# Altium schematic sheet UART.SchDoc: Grandmaster UART, Antennas, and RTC
size Tabloid; Author: N Smith; Revision: A; SheetNumber: 3; SheetTotal: 6; Customer: 01910
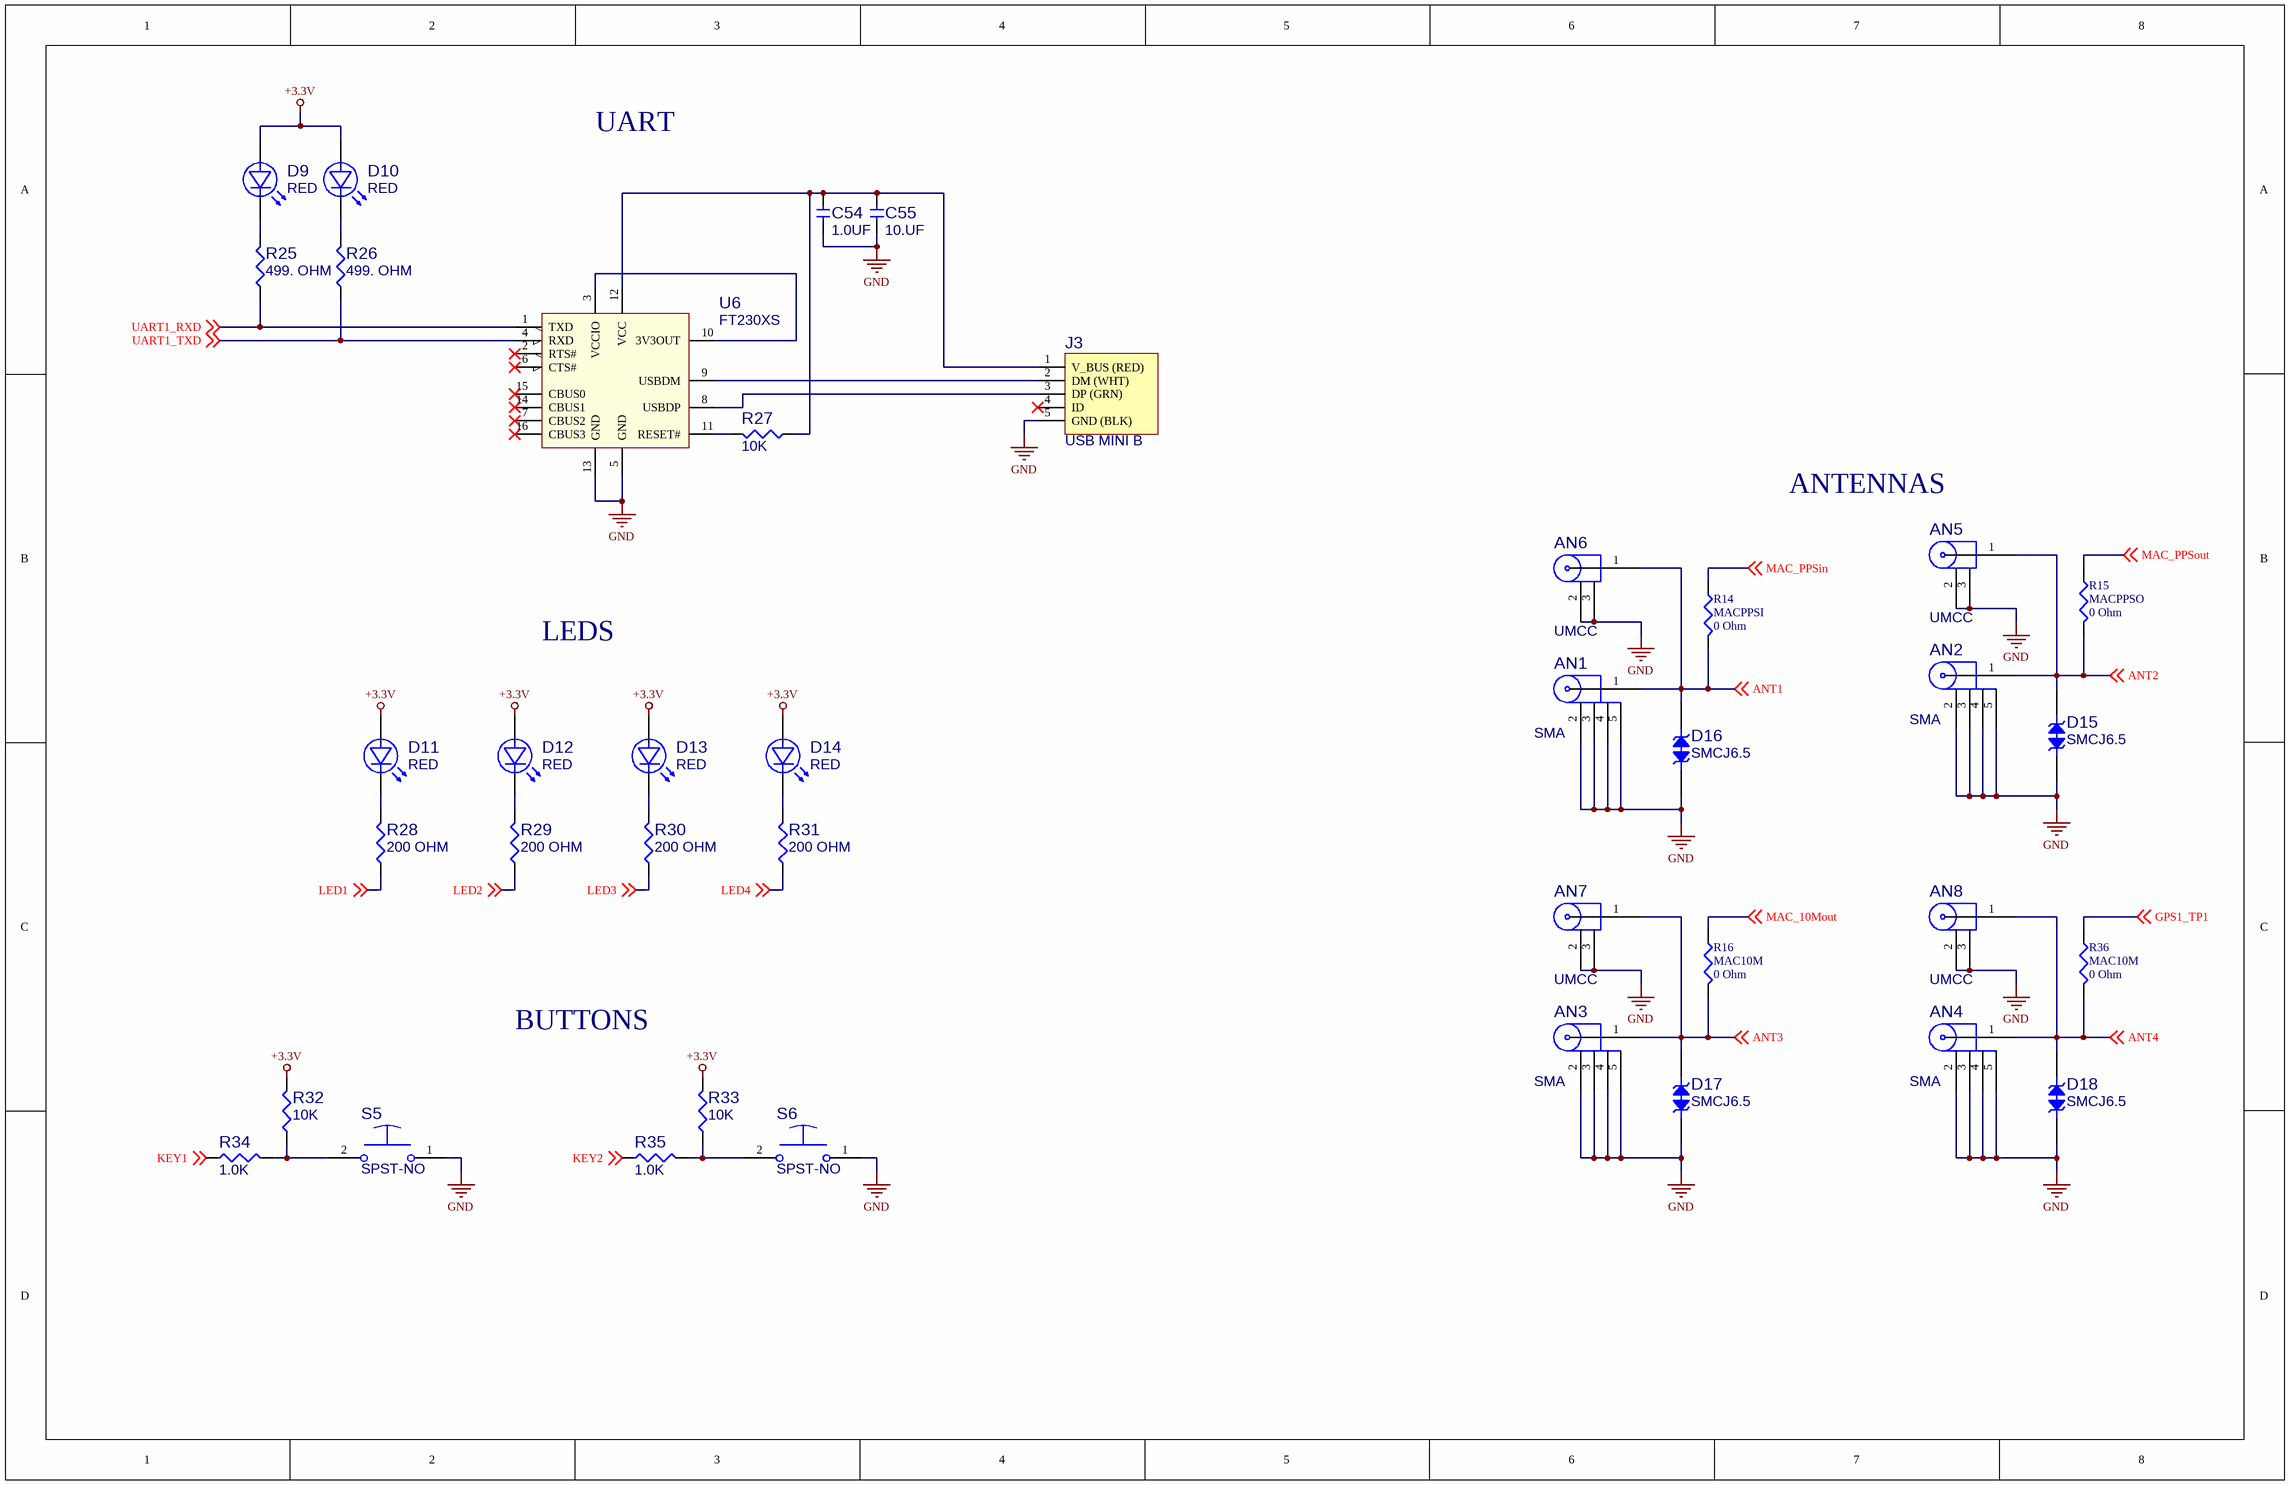
[diagram p0: UART.SchDoc]

## Parts
AN1  value SMA  [AMPHENOL-901-143-6RFX]  (hidden comment: RF-901-143-6FRX)
AN2  value SMA  [AMPHENOL-901-143-6RFX]  (hidden comment: RF-901-143-6FRX)
AN3  value SMA  [AMPHENOL-901-143-6RFX]  (hidden comment: RF-901-143-6FRX)
AN4  value SMA  [AMPHENOL-901-143-6RFX]  (hidden comment: RF-901-143-6FRX)
AN5  value UMCC  [U.FL UMCC JACK]  (hidden comment: 1909763-1)
AN6  value UMCC  [U.FL UMCC JACK]  (hidden comment: 1909763-1)
AN7  value UMCC  [U.FL UMCC JACK]  (hidden comment: 1909763-1)
AN8  value UMCC  [U.FL UMCC JACK]  (hidden comment: 1909763-1)
C54  value 1.0UF  [CAPC2012X14N]  (hidden comment: CAP_0805_1UF_25V)
C55  value 10.UF  [CAPC1608X10N]  (hidden comment: GRT188R61E106ME13D)
D9  RED  [DIOM1608X06N]
D10  RED  [DIOM1608X06N]
D11  RED  [DIOM1608X06N]
D12  RED  [DIOM1608X06N]
D13  RED  [DIOM1608X06N]
D14  RED  [DIOM1608X06N]
D15  value SMCJ6.5  [DIOM6959X26N]  (hidden comment: SMCJ6.5CA)
D16  value SMCJ6.5  [DIOM6959X26N]  (hidden comment: SMCJ6.5CA)
D17  value SMCJ6.5  [DIOM6959X26N]  (hidden comment: SMCJ6.5CA)
D18  value SMCJ6.5  [DIOM6959X26N]  (hidden comment: SMCJ6.5CA)
J3  value USB MINI B  [USB_1734035]  (hidden comment: USB_B_1734035)
R14  MACPPSI  value 0 Ohm  [J1-0603]
R15  MACPPSO  value 0 Ohm  [J1-0603]
R16  MAC10M  value 0 Ohm  [J1-0603]
R25  value 499. OHM  [RESC1005X04N]  (hidden comment: ERJ-2RKF4990X)
R26  value 499. OHM  [RESC1005X04N]  (hidden comment: ERJ-2RKF4990X)
R27  value 10K  [RESC1608X50N]  (hidden comment: ERJ-3EKF1002V)
R28  value 200 OHM  [RESC1608X50N]  (hidden comment: ERJ-3EKF2000V)
R29  value 200 OHM  [RESC1608X50N]  (hidden comment: ERJ-3EKF2000V)
R30  value 200 OHM  [RESC1608X50N]  (hidden comment: ERJ-3EKF2000V)
R31  value 200 OHM  [RESC1608X50N]  (hidden comment: ERJ-3EKF2000V)
R32  value 10K  [RESC1608X50N]  (hidden comment: ERJ-3EKF1002V)
R33  value 10K  [RESC1608X50N]  (hidden comment: ERJ-3EKF1002V)
R34  value 1.0K  [RESC1608X50N]  (hidden comment: ERJ-3EKF1001V)
R35  value 1.0K  [RESC1608X50N]  (hidden comment: ERJ-3EKF1001V)
R36  MAC10M  value 0 Ohm  [J1-0603]
S5  value SPST-NO  [OMRON-B3U-1000P]  (hidden comment: B3U-1000P)
S6  value SPST-NO  [OMRON-B3U-1000P]  (hidden comment: B3U-1000P)
U6  value FT230XS  [SOP64P600X170-16N]  (hidden comment: FT230XS-R)

## Nets
+3.3V: D9.2(A) D10.2(A) D11.2(A) D12.2(A) D13.2(A) D14.2(A) R32.2 R33.2
GND: AN1.2 AN1.3 AN1.4 AN1.5 AN2.2 AN2.3 AN2.4 AN2.5 AN3.2 AN3.3 AN3.4 AN3.5 AN4.2 AN4.3 AN4.4 AN4.5 AN5.2 AN5.3 AN6.2 AN6.3 AN7.2 AN7.3 AN8.2 AN8.3 C54.1 C55.1 D15.K D16.K D17.K D18.K J3.5(GND_(BLK)) S5.1 S6.1 U6.5(GND) U6.13(GND)
ANT1: AN1.1 AN6.1 D16.A R14.2 ; off-sheet ANT1
ANT2: AN2.1 AN5.1 D15.A R15.2 ; off-sheet ANT2
ANT3: AN3.1 AN7.1 D17.A R16.2 ; off-sheet ANT3
ANT4: AN4.1 AN8.1 D18.A R36.2 ; off-sheet ANT4
GPS1_TP1: R36.1 ; off-sheet GPS1_TP1
KEY1: R34.1 ; off-sheet KEY1
KEY2: R35.1 ; off-sheet KEY2
LED1: R28.1 ; off-sheet LED1
LED2: R29.1 ; off-sheet LED2
LED3: R30.1 ; off-sheet LED3
LED4: R31.1 ; off-sheet LED4
MAC_10Mout: R16.1 ; off-sheet MAC_10Mout
MAC_PPSin: R14.1 ; off-sheet MAC_PPSin
MAC_PPSout: R15.1 ; off-sheet MAC_PPSout
UART1_RXD: R25.1 U6.1(TXD) ; off-sheet UART1_RXD
UART1_TXD: R26.1 U6.4(RXD) ; off-sheet UART1_TXD
NetC54_2: C54.2 C55.2 J3.1(V_BUS_(RED)) R27.1 U6.12(VCC)
NetD9_1: D9.1(K) R25.2
NetD10_1: D10.1(K) R26.2
NetD11_1: D11.1(K) R28.2
NetD12_1: D12.1(K) R29.2
NetD13_1: D13.1(K) R30.2
NetD14_1: D14.1(K) R31.2
NetJ3_2: J3.2(DM_(WHT)) U6.9(USBDM)
NetJ3_3: J3.3(DP_(GRN)) U6.8(USBDP)
NetR27_2: R27.2 U6.11(RESET#)
NetR32_1: R32.1 R34.2 S5.2
NetR33_1: R33.1 R35.2 S6.2
NetU6_3: U6.3(VCCIO) U6.10(3V3OUT)

Not connected (* = marked no-connect by the designer): J3 4(ID)*; U6 2(RTS#)* 6(CTS#)* 7(CBUS2)* 14(CBUS1)* 15(CBUS0)* 16(CBUS3)*

## Notes on the sheet
- UART
- ANTENNAS
- LEDS
- BUTTONS

## Library data of the parts
AN1-AN4 = RF-901-143-6FRX: CONN, JACK, SMA, FEMALE, 50 OHM, R/A, GOLD, TH; MFG PART NUM: 901-143-6RFX; VALENTIUM PART NUM: <VALENTIUM>; MFG Name: AMPHENOL; MAXTEMP: 165C; MINTEMP: -65C; P2: 50 OHM; MODIFY DATE: 10/10/2013; CATEGORY: CONN, JACK; OTHER: GOLD; P1: FEMALE; P3: R/A; SIZE: 9.86MM HT; DESC: CONN, JACK, SMA, FEMALE, 50 OHM, R/A, GOLD, TH; Supplier 1: Digi-Key; Supplier Part Number 1: ARFX1232-ND
AN5-AN8 = UMCC: CONN, JACK, UMCC, MALE, 50 OHM, U.FL, GOLD, SMT; VALENTIUM PART NUM: <VALENTIUM>; MFG Name: TE; MAXTEMP: 90C; MINTEMP: -40C; P2: 50 OHM; P3: ST; MFG PART NUM: 1909763-1; MODIFY DATE: 10/10/2013; CATEGORY: CONN, JACK; OTHER: GOLD; P1: MALE; SIZE: 1.25MM HT; DESC: CONN, JACK, UMCC, MALE, 50 OHM, U.FL, GOLD, SMT; Supplier 1: Digi-Key; Supplier Part Number 1: A118077CT-ND
C54 = CAP_0805_1UF_25V: CAP, CER, 1.0UF, 25V, 10%, X5R, 0805; MFG PART NUM: 08053D105KAT2A; VALENTIUM PART NUM: <VALENTIUM>; MFG NAME: AVX; MAXTEMP: 85C; MINTEMP: -55C; MODIFY DATE: 10/23/2013; CATEGORY: CAP, CER; Date: 4/11/2006 3:37:28 PM; SHEETPART: *; P1: 10%; P2: 25V; P3: X5R; Size: 0805; Supplier 1: Digi-Key; Supplier Part Number 1: 478-1409-1-ND; DESC: CAP, CER, 1.0UF, 25V, 10%, X5R, 0805
C55 = CAP_0603_10UF_25V: CAP, CER, 10.UF, 25V, 20%, X5R, AEC-Q200, 0603; VALENTIUM PART NUM: <VALENTIUM>; MFG NAME: MURATA; MAXTEMP: 85C; MINTEMP: -55C; CATEGORY: CAP, CER; MFG PART NUM: GRT188R61E106ME13D; MODIFY DATE: 10/23/2013; Date: 7/25/2013; SHEETPART: *; P1: 20%; OTHER: AEC-Q200; P2: 25V; P3: X5R; Size: 0603; DESC: CAP, CER, 10.UF, 25V, 20%, X5R, AEC-Q200, 0603; Supplier 1: Digi-Key; Supplier Part Number 1: 490-12323-6-ND
D9-D14 = SMTLED_RED_0603_SML: LED, RED, SML-LX0603, 635NM, 2V, 20MA, 0603; MFG PART NUM: SML-LX0603IW-TR; VALENTIUM PART NUM: <VALENTIUM>; MFG NAME: LUMEX; MAXTEMP: 85C; MINTEMP: -25C; MODIFY DATE: 9/4/2013; CATEGORY: LED; OTHER: SML-LX0603; P1: 635NM; P2: 2V; P3: 20MA; SIZE: 0603; SHEETPART: *; DESC: LED, RED, SML-LX0603, 635NM, 2V, 20MA, 0603; Supplier 1: Digi-Key; Supplier Part Number 1: 67-1548-1-ND; VALUE: RED
D15-D18 = SMCJ6.5CA: DIO, TVS, SMCJ6.5, 6.5V, BIDIR, 1.5KW, SMC; VALENTIUM PART NUM: <VALENTIUM>; MFG NAME: LITTELFUSE; MAXTEMP: 150C; MINTEMP: -55C; OTHER: SMCJ; MFG PART NUM: SMCJ6.5CA; MODIFY DATE: 9/4/2013; CATEGORY: DIO, TVS; P1: 6.5V; P2: BIDIR; P3: 1.5KW; SIZE: SMC; SHEETPART: *; Supplier 1: Digi-Key; Supplier Part Number 1: SMCJ6.5CALFCT-ND; DESC: DIO, TVS, SMCJ6.5, 6.5V, BIDIR, 1.5KW, SMC
J3 = USB_B_1734035: CONN, REC, USB, R/A, MINI, TYPE B, 5 POS, SMT W/BRD GUIDE; MFG PART NUM: 1734035-2; VALENTIUM PART NUM: <VALENTIUM>; MFG NAME: TE CONNECTIVITY/AMP; MAXTEMP: C; P2: 5 POS; CATEGORY: CONN, REC; MODIFY DATE: 10/10/2013; MINTEMP: C; OTHER: USB; P1: R/A; P3: USB MINI B; SIZE: SMT; DESC: CONN, REC, USB, R/A, MINI, TYPE B, 5 POS, SMT W/BRD GUIDE; Supplier 1: Digi-Key; Supplier Part Number 1: A31727CT-ND
R14-R16 R36 = Res3: Resistor; Published: 8-Jun-2000; LatestRevisionDate: 29-May-2009; LatestRevisionNote: IPC-7351 Footprint Added.; PackageReference: J1-0603; Publisher: Altium Limited; PackageDescription: Chip Resistor
R25 R26 = RES_0402_499: RES, 499. OHM, 1%, 1/16W, TF, AEC-Q200, 0402; VELENTIUM PART NUM: <VELENTIUM>; MFG NAME: PANASONIC; MAXTEMP: 155C; MINTEMP: -55C; OTHER: 100PPM, AEC-Q200; SUB: GENERIC; ModifyDate: 7/25/2013; MFG PART NUM: ERJ-2RKF4990X; CATEGORY: RES; Date: 7/26/2013; P1: 1%; P3: TF; P2: 1/16W; SIZE: 0402; SHEETPART: *; DESC: RES, 499. OHM, 1%, 1/16W, TF, AEC-Q200, 0402; Supplier 1: Digi-Key; Supplier Part Number 1: P499LCT-ND
R27 R32 R33 = RES_0603_10K: RES, 10K, 1%, 1/10W, TF, 0603; VELENTIUM PART NUM: <VELENTIUM>; MFG NAME: PANASONIC; MAXTEMP: 125C; MINTEMP: -55C; OTHER: 100PPM; SUB: GENERIC; ModifyDate: 7/25/2013; MFG PART NUM: ERJ-3EKF1002V; CATEGORY: RES; Date: 7/26/2013; P1: 1%; P3: TF; P2: 1/10W; SIZE: 0603; Supplier 1: Digi-Key; Supplier Part Number 1: P10.0KHCT-ND; SHEETPART: *; DESC: RES, 10K, 1%, 1/10W, TF, 0603
R28-R31 = RES_0603_200: RES, 200 OHM, 1%, 1/10W, TF, 0603; VELENTIUM PART NUM: <VELENTIUM>; MFG NAME: PANASONIC; MAXTEMP: 125C; MINTEMP: -55C; OTHER: 100PPM; SUB: GENERIC; ModifyDate: 7/25/2013; MFG PART NUM: ERJ-3EKF2000V; CATEGORY: RES; Date: 7/26/2013; P1: 1%; P3: TF; P2: 1/10W; SIZE: 0603; SHEETPART: *; DESC: RES, 200 OHM, 1%, 1/10W, TF, 0603; Supplier 1: Digi-Key; Supplier Part Number 1: P200HCT-ND
R34 R35 = RES_0603_1.0K: RES, 1.0K, 1%, 1/10W, TF, 0603; VELENTIUM PART NUM: <VELENTIUM>; MFG NAME: PANASONIC; MAXTEMP: 125C; MINTEMP: -55C; OTHER: 100PPM; SUB: GENERIC; ModifyDate: 7/25/2013; MFG PART NUM: ERJ-3EKF1001V; CATEGORY: RES; Date: 7/26/2013; P1: 1%; P3: TF; P2: 1/10W; SIZE: 0603; Supplier 1: Digi-Key; Supplier Part Number 1: P1.00KHCT-ND; SHEETPART: *; DESC: RES, 1.0K, 1%, 1/10W, TF, 0603
S5 S6 = B3U-1000P: SW, SPST-NO, TACT, 12V, 50MA, 3X2.5MM SMT, B3U SERIES; VALENTIUM PART NUM: <VALENTIUM>; MFG NAME: OMRON; MAXTEMP: 70C; MINTEMP: -25C; MFG PART NUM: B3U-1000P; MODIFY DATE: 9/5/2013; CATEGORY: SW; OTHER: B3U SERIES; P1: 12V; P2: 50mA; P3: TACT; SIZE: 3X2.5MM; SHEETPART: *; DESC: SW, SPST-NO, TACT, 12V, 50MA, 3X2.5MM SMT, B3U SERIES; Supplier 1: Digi-Key; Supplier Part Number 1: SW1020CT-ND
U6 = FT230XS-R: IC, TCVR, FT230, USB TO UART, 5V, FTDI, 16SSOP; VELENTIUM PART NUM: <V PART NUM>; MAXTEMP: 85C; MINTEMP: -40C; MFG PART NUM: FT230XS-R; MFG NAME: FTDI; MODIFY DATE: 8/14/2013; CATEGORY: IC, TCVR; P1: USB TO UART; P2: 5V; P3: FTDI; SIZE: 20SSOP; SHEETPART: *; DESC: IC, TCVR, FT230, USB TO UART, 5V, FTDI, 16SSOP; Supplier 1: Digi-Key; Supplier Part Number 1: 768-1135-1-ND